# Altium schematic sheet SPI.SchDoc
size A3; SheetNumber: 17; SheetTotal: 29
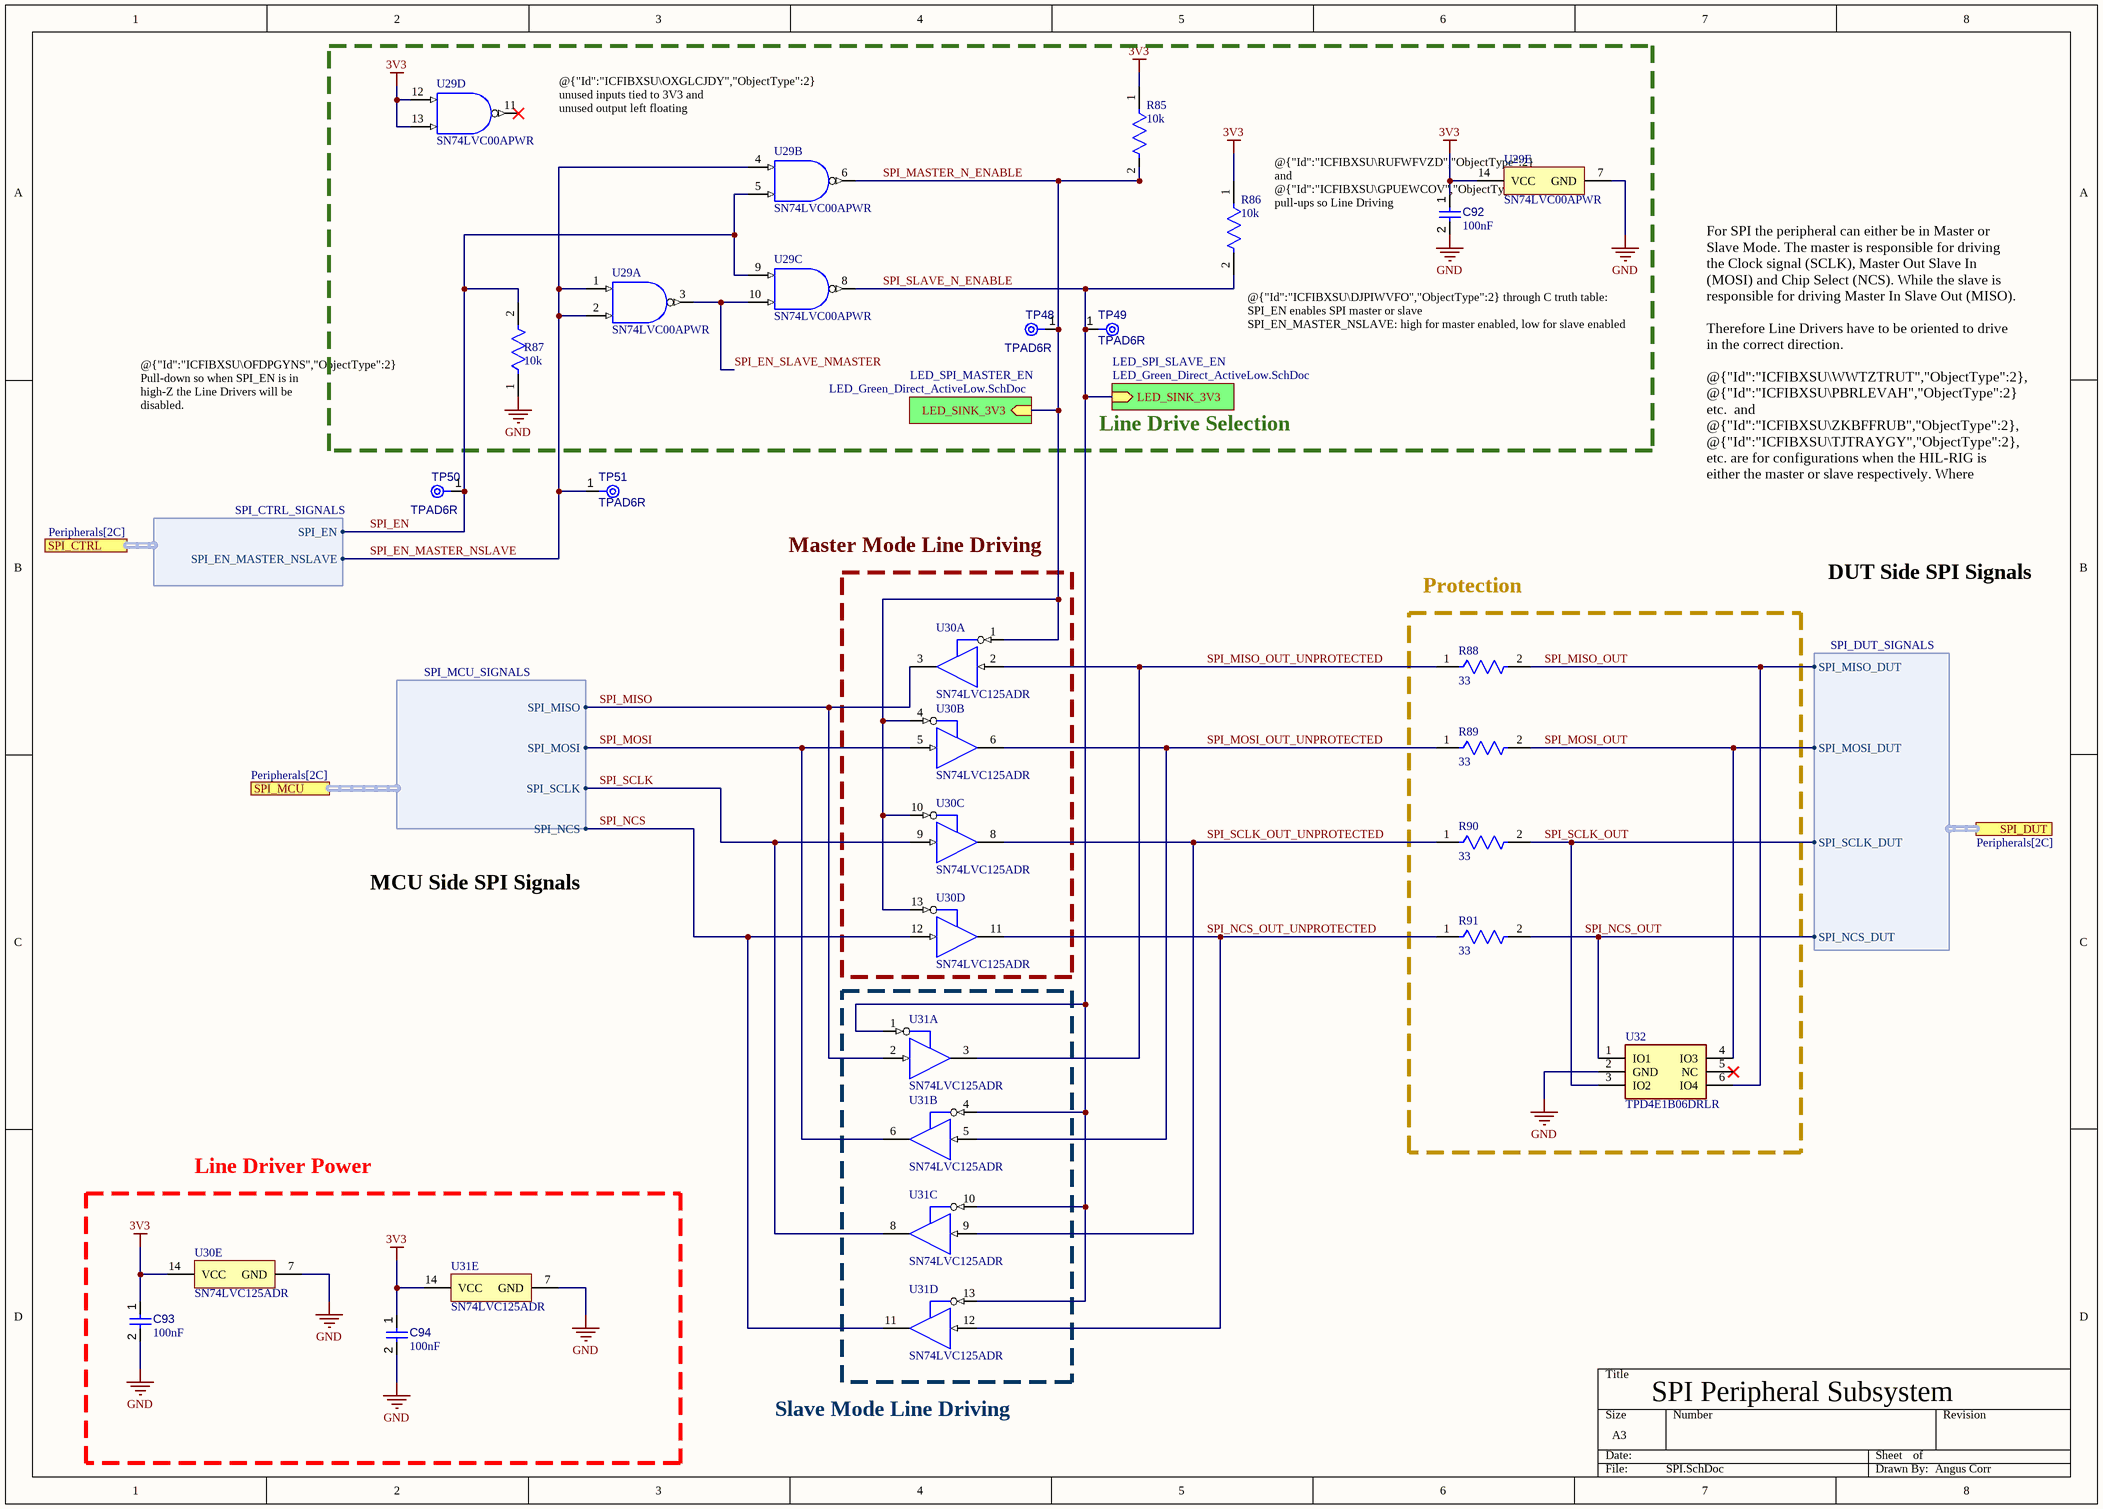
[diagram p0: SPI.SchDoc]

## Parts
C92  value 100nF  [CAPC1608X90X40NL10T20]  (hidden comment: Capacitor 100 nF +/-10% 50 V 0603)
C93  value 100nF  [CAPC1608X90X40NL10T20]  (hidden comment: Capacitor 100 nF +/-10% 50 V 0603)
C94  value 100nF  [CAPC1608X90X40NL10T20]  (hidden comment: Capacitor 100 nF +/-10% 50 V 0603)
R85  value 10k  [FP-RT0603-IPC_C]  (hidden comment: RT0603BRD0710KL)
R86  value 10k  [FP-RT0603-IPC_C]  (hidden comment: RT0603BRD0710KL)
R87  value 10k  [FP-RT0603-IPC_C]  (hidden comment: RT0603BRD0710KL)
R88  value 33  [FP-AC0603-IPC_C]  (hidden comment: AC0603FR-0733RL)
R89  value 33  [FP-AC0603-IPC_C]  (hidden comment: AC0603FR-0733RL)
R90  value 33  [FP-AC0603-IPC_C]  (hidden comment: AC0603FR-0733RL)
R91  value 33  [FP-AC0603-IPC_C]  (hidden comment: AC0603FR-0733RL)
TP48  TPAD6R  [TP06R]  (no BOM)
TP49  TPAD6R  [TP06R]  (no BOM)
TP50  TPAD6R  [TP06R]  (no BOM)
TP51  TPAD6R  [TP06R]  (no BOM)
U29  SN74LVC00APWR  [FP-PW0014A-IPC_B]  (parts A,B,C,D,E of 5)
U30  SN74LVC125ADR  [FP-D0014A-MFG]  (parts A,B,C,D,E of 5)
U31  SN74LVC125ADR  [FP-D0014A-MFG]  (parts A,B,C,D,E of 5)
U32  TPD4E1B06DRLR  [SOTFL50P160X60-6N]

## Blocks framed on the sheet
Line Drive Selection: C92 R85-R87 TP48 TP49 U29
Protection: R88-R91 U32
Line Driver Power: C93 C94 U30 U31

## Sub-sheets
LED_SPI_MASTER_EN = LED_Green_Direct_ActiveLow.SchDoc: LED_SINK_3V3 (in)
LED_SPI_SLAVE_EN = LED_Green_Direct_ActiveLow.SchDoc: LED_SINK_3V3 (in)

## Ports
SPI_CTRL (harness SPI_CTRL_SIGNALS, see Peripherals[2C]), SPI_DUT (harness SPI_DUT_SIGNALS, see Peripherals[2C]), SPI_MCU (harness SPI_MCU_SIGNALS, see Peripherals[2C])

## Harnesses
SPI_MCU_SIGNALS: SPI_MISO, SPI_MOSI, SPI_SCLK, SPI_NCS
SPI_DUT_SIGNALS: SPI_MISO_DUT, SPI_MOSI_DUT, SPI_SCLK_DUT, SPI_NCS_DUT
SPI_CTRL_SIGNALS: SPI_EN_MASTER_NSLAVE, SPI_EN

## Nets
3V3: C92.1 C93.1 C94.1 R85.1 R86.1 U29.12(4A) U29.13(4B) U29.14(VCC) U30.14(VCC) U31.14(VCC)
GND: C92.2 C93.2 C94.2 R87.1 U29.7(GND) U30.7(GND) U31.7(GND) U32.2(GND)
SPI_EN: R87.2 TP50.1(TP) U29.5(2B) U29.9(3A) ; port SPI_CTRL.SPI_EN
SPI_EN_MASTER_NSLAVE: TP51.1(TP) U29.1(1A) U29.2(1B) U29.4(2A) ; port SPI_CTRL.SPI_EN_MASTER_NSLAVE
SPI_EN_SLAVE_NMASTER: U29.3(1Y) U29.10(3B)
SPI_MASTER_N_ENABLE: R85.2 TP48.1(TP) U29.6(2Y) U30.1(1~{OE}) U30.4(2~{OE}) U30.10(3~{OE}) U30.13(4~{OE}) ; sheet LED_SPI_MASTER_EN/LED_SINK_3V3
SPI_MISO: U30.3(1Y) U31.2(1A) ; port SPI_MCU.SPI_MISO
SPI_MISO_OUT: R88.2 U32.6(IO4) ; port SPI_DUT.SPI_MISO_DUT
SPI_MISO_OUT_UNPROTECTED: R88.1 U30.2(1A) U31.3(1Y)
SPI_MOSI: U30.5(2A) U31.6(2Y) ; port SPI_MCU.SPI_MOSI
SPI_MOSI_OUT: R89.2 U32.4(IO3) ; port SPI_DUT.SPI_MOSI_DUT
SPI_MOSI_OUT_UNPROTECTED: R89.1 U30.6(2Y) U31.5(2A)
SPI_NCS: U30.12(4A) U31.11(4Y) ; port SPI_MCU.SPI_NCS
SPI_NCS_OUT: R91.2 U32.1(IO1) ; port SPI_DUT.SPI_NCS_DUT
SPI_NCS_OUT_UNPROTECTED: R91.1 U30.11(4Y) U31.12(4A)
SPI_SCLK: U30.9(3A) U31.8(3Y) ; port SPI_MCU.SPI_SCLK
SPI_SCLK_OUT: R90.2 U32.3(IO2) ; port SPI_DUT.SPI_SCLK_DUT
SPI_SCLK_OUT_UNPROTECTED: R90.1 U30.8(3Y) U31.9(3A)
SPI_SLAVE_N_ENABLE: R86.2 TP49.1(TP) U29.8(3Y) U31.1(1~{OE}) U31.4(2~{OE}) U31.10(3~{OE}) U31.13(4~{OE}) ; sheet LED_SPI_SLAVE_EN/LED_SINK_3V3

Not connected (* = marked no-connect by the designer): U29 11(4Y)*; U32 5(NC)*

## Notes on the sheet
- @{"Id":"ICFIBXSU\OXGLCJDY","ObjectType":2} unused inputs tied to 3V3 and unused output left floating
- (near C92) @{"Id":"ICFIBXSU\RUFWFVZD","ObjectType":2} and @{"Id":"ICFIBXSU\GPUEWCOV","ObjectType":2} pull-ups so Line Driving Disabled on Power On
- @{"Id":"ICFIBXSU\DJPIWVFO","ObjectType":2} through C truth table:
  SPI_EN enables SPI master or slave
  SPI_EN_MASTER_NSLAVE: high for master enabled, low for slave enabled
- @{"Id":"ICFIBXSU\OFDPGYNS","ObjectType":2} Pull-down so when SPI_EN is in high-Z the Line Drivers will be disabled.
- For SPI the peripheral can either be in Master or Slave Mode. The master is responsible for driving the Clock signal (SCLK), Master Out Slave In (MOSI) and Chip Select (NCS). While the slave is responsible for driving Master In Slave Out (MISO).
  Therefore Line Drivers have to be oriented to drive in the correct direction.
  @{"Id":"ICFIBXSU\WWTZTRUT","ObjectType":2}, @{"Id":"ICFIBXSU\PBRLEVAH","ObjectType":2} etc.  and @{"Id":"ICFIBXSU\ZKBFFRUB","ObjectType":2}, @{"Id":"ICFIBXSU\TJTRAYGY","ObjectType":2}, etc. are for configurations when the HIL-RIG is either the master or slave respectively. Where @{"Id":"ICFIBXSU\DJPIWVFO","ObjectType":2}->E ensures that the HIL-RIG can only be configured as either master or slave.
- Master Mode Line Driving
- DUT Side SPI Signals
- MCU Side SPI Signals
- Slave Mode Line Driving
- SPI Peripheral Subsystem
- Angus Corr

## Library data of the parts
C92-C94 = CMP-001-00017-6: Chip Capacitor, 100 nF, +/- 10%, 50 V, 0603 (1608 Metric); Voltage Rating: 50V; Capacitor Type: Ceramic; Tolerance: 10%; Mounting Technology: SM; Max Operating Temperature: 125°C; RoHS Compliant: True; Pins: 2; Case/Package: 0603; Min Operating Temperature: -55°C
R85-R87 = CMP-009-00322-1: Res Thin Film 0603 10K Ohm 0.1% 1/10W |25ppm/|C SMD Paper T/R; Voltage Rating: 75V; Max Power Dissipation: 100mW; Temperature Coefficient: 25ppm/°C; Min Operating Temperature: -55°C; Case/Package: 0603; Mounting Technology: Surface Mount; Max Operating Temperature: 155°C; Tolerance: 0.1%; Case Code (Imperial): 0603; China RoHS: Non-Compliant; Composition: Thin Film; Country of Origin: Mainland China, Taiwan; Depth: 800µm; Export Control Classification Number (ECCN) Code: EAR99; Features: Moisture Resistant; Harmonized Tariff Schedule (HTS) Code: 8533.21.00.30; Height: 450µm; Introduction Date: 2008-06-09; Lead Free: Lead Free; Length: 1.6mm; Lifecycle Status: Production; Military Standard: Not; Number of Terminals: 2; Number of Terminations: 2; Power Rating: 100mW; REACH SVHC: Yes; RoHS: Compliant; Schedule B: 8533210045, 8533210045; Termination: SMD/SMT; Voltage Rating (DC): 75V; Weight: 2.012816mg; Width: 800µm; Working Voltage: 75V
R88-R91 = CMP-009-00258-1: Res Thick Film 0603 33 Ohm 1% 0.1W(1/10W) ±100ppm/C Pad SMD T/R Automotive AEC-Q200; Voltage Rating: 75V; Max Power Dissipation: 100mW; Temperature Coefficient: 100ppm/°C; Min Operating Temperature: -55°C; Tolerance: 1%; Mounting Technology: Surface Mount; Max Operating Temperature: 155°C; Case/Package: 0603; Case Code (Imperial): 0603; China RoHS: Non-Compliant; Composition: Thick Film; Country of Origin: Mainland China, Taiwan; Export Control Classification Number (ECCN) Code: EAR99; Harmonized Tariff Schedule (HTS) Code: 8533.21.00.30; Height: 450µm; Introduction Date: 2012-04-10; Length: 1.6mm; Lifecycle Status: Production; Number of Terminals: 2; Number of Terminations: 2; Power Rating: 100mW; REACH SVHC: Yes; RoHS: Compliant; Schedule B: 8533210045, 8533210045; Termination: SMD/SMT; Width: 800µm; Working Voltage: 75V; Case Code (Metric): 1608; Features: Automotive AEC-Q200, Moisture Resistant; Packaging: Tape & Reel; Power Dissipation: 100mW; Ratings: AEC-Q200
TP48-TP51 = CMP-00028-00002-2: 0.6mm round; Pins: 1
U29 = CMP-016-00024-1: 4.1NS@ 3.3V, 50PF 1 2 4 4 1.65V 3.6V 24MA Nand Gate Lvc 24MA TSSOP-14 , 1.2MM; Manufacturer Lifecycle Status: ACTIVE; Number of Outputs: 1; Turn-On Delay Time: 4.3ns; Propagation Delay: 3.5ns; High Level Output Current: -24mA; Number of Inputs: 2; Number of Bits: 4; Nominal Supply Current: 1µA; Max Junction Temperature (Tj): 150°C; Schmitt Trigger Input: No; Case/Package: TSSOP; Length: 5mm; Lead Free: Lead Free; Radiation Hardening: No; Min Operating Temperature: -40°C; Weight: 57.209338mg; Packaging: Tape & Reel; RoHS: Compliant; Height: 0m; Mounting Technology: Surface Mount; Number of Input Lines: 2; Thickness: 1mm; Width: 4.4mm; Min Supply Voltage: 1.65V; Logic Function: NAND; Quiescent Current: 1µA; Pins: 14; Low Level Output Current: 24mA; Lifecycle Status: Production; Number of Elements: 4; Max Operating Temperature: 125°C; Number of Gates: 4; Number of Circuits: 4; Number of Output Lines: 1; Max Supply Voltage: 3.6V; Contact Plating: Gold; Max Output current: 24mA; Number of Channels: 4; Output Current: 24mA; REACH SVHC: No; Schedule B: 8542390000, 8542390000; Termination: SMD/SMT
U30 U31 = CMP-00024-00010-1: 24mA 24mA 1.65V~3.6V -40℃~+125℃ Tri-State SOIC-14 Buffer/Driver/Transceiver ROHS; Manufacturer Lifecycle Status: ACTIVE; Min Supply Voltage: 1.65V; Max Supply Voltage: 3.6V; High Level Output Current: -24mA; Logic Function: Buffer, Inverting; Max Power Dissipation: 500mW; Nominal Supply Current: 40µA; Number of Bits per Element: 1; Number of Bits: 4; Number of Output Lines: 3; Polarity: Non-Inverting; Propagation Delay: 2.5ns; Quiescent Current: 1µA; Turn-On Delay Time: 15.8ns; Pins: 14; Min Operating Temperature: -40°C; Max Operating Temperature: 125°C; Case/Package: SOIC; Mounting Technology: Surface Mount; Height: 0m; Lead Free: Lead Free; Length: 8.65mm; Lifecycle Status: Production; Low Level Output Current: 24mA; Number of Channels: 4; Number of Circuits: 4; Number of Elements: 4; Number of Gates: 4; Number of Input Lines: 4; Number of Inputs: 4; Number of Outputs: 4; Packaging: Tape & Reel; Radiation Hardening: No; REACH SVHC: No; RoHS: Compliant; Schedule B: 8542390000, 8542390000; Thickness: 1.58mm; Width: 3.91mm
U32 = CMP-031-00023-1: Bidirectional Quad-Channel High-Speed ESD Protection Device; Manufacturer_Name: Texas Instruments; Manufacturer_Part_Number: TPD4E1B06DRLR; Mouser Part Number: 595-TPD4E1B06DRLR; Datasheet Link: http://www.ti.com/lit/ds/symlink/tpd4e1b06.pdf; Source: MAX17643ATC+.SchLib; Height: 0.6mm; Mouser Price/Stock: https://www.mouser.co.uk/ProductDetail/Texas-Instruments/TPD4E1B06DRLR?qs=1MXlzafEN387aRSX0e2MEQ%3D%3D; Arrow Price/Stock: https://www.arrow.com/en/products/tpd4e1b06drlr/texas-instruments?utm_currency=USD&region=nac; Design Item ID: TPD4E1B06DRLR; Arrow Part Number: TPD4E1B06DRLR